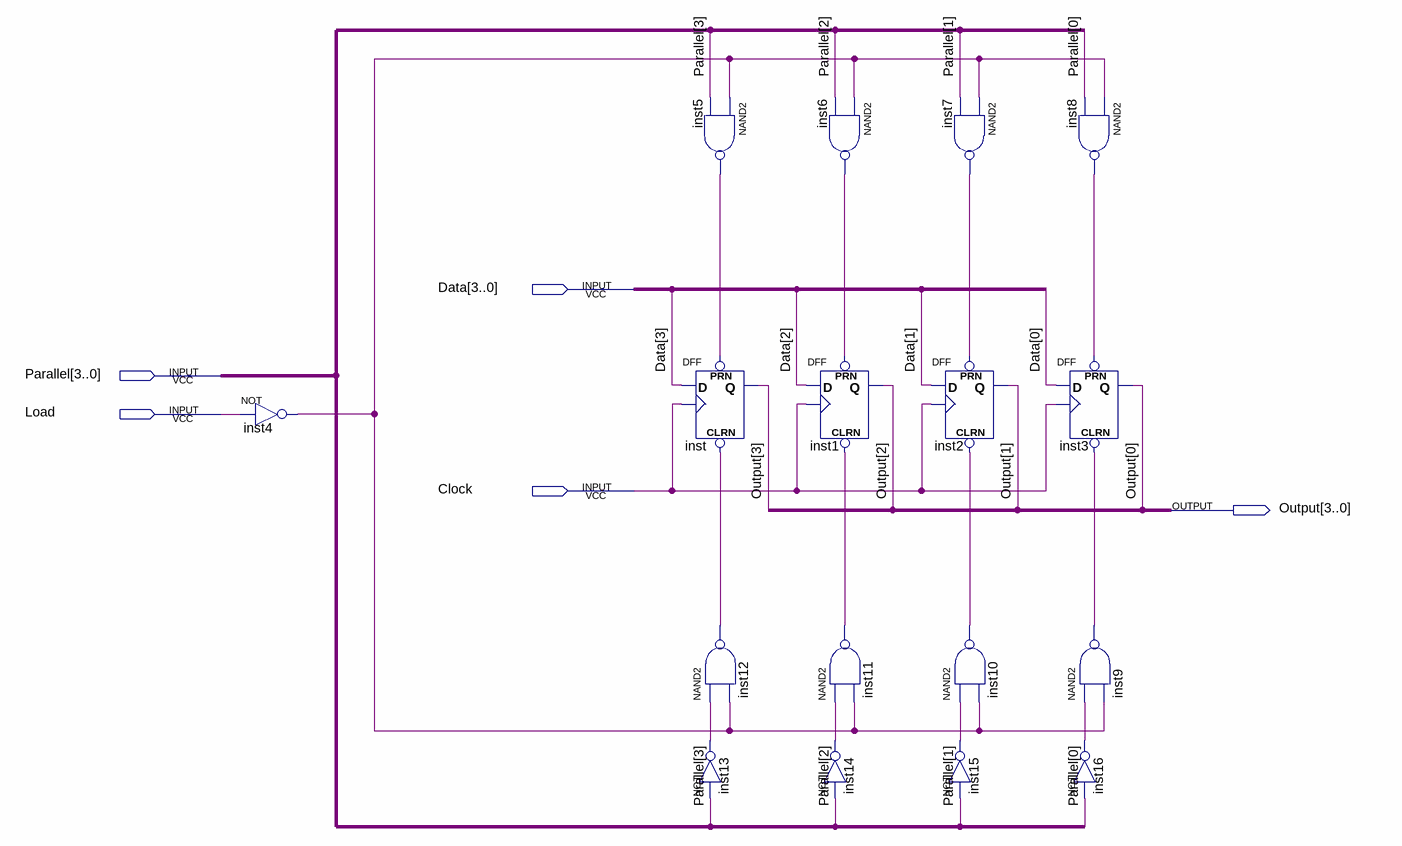
[diagram p0: schematic sheet]
// Quartus schematic Register_4Bits.bdf as structural Verilog: 17 symbols, 5 pins
module Register_4Bits (
  input  [3:0] Data,
  input  [3:0] Parallel,
  input  Load,
  input  Clock,
  output [3:0] Output
);

  wire inst4_out, inst5_out, inst6_out, inst7_out, inst8_out, inst9_out, inst10_out, inst11_out, inst12_out,
       inst13_out, inst14_out, inst15_out, inst16_out;

  not inst4 (inst4_out, Load);
  nand inst5 (inst5_out, inst4_out, Parallel[3]);
  DFF inst (.CLRN(inst12_out), .CLK(Clock), .D(Data[3]), .PRN(inst5_out), .Q(Output[3]));
  nand inst12 (inst12_out, inst13_out, inst4_out);
  not inst13 (inst13_out, Parallel[3]);
  nand inst6 (inst6_out, inst4_out, Parallel[2]);
  DFF inst1 (.CLRN(inst11_out), .CLK(Clock), .D(Data[2]), .PRN(inst6_out), .Q(Output[2]));
  nand inst11 (inst11_out, inst14_out, inst4_out);
  not inst14 (inst14_out, Parallel[2]);
  nand inst7 (inst7_out, inst4_out, Parallel[1]);
  DFF inst2 (.CLRN(inst10_out), .CLK(Clock), .D(Data[1]), .PRN(inst7_out), .Q(Output[1]));
  nand inst10 (inst10_out, inst15_out, inst4_out);
  not inst15 (inst15_out, Parallel[1]);
  nand inst8 (inst8_out, inst4_out, Parallel[0]);
  DFF inst3 (.CLRN(inst9_out), .CLK(Clock), .D(Data[0]), .PRN(inst8_out), .Q(Output[0]));
  nand inst9 (inst9_out, inst16_out, inst4_out);
  not inst16 (inst16_out, Parallel[0]);
endmodule
